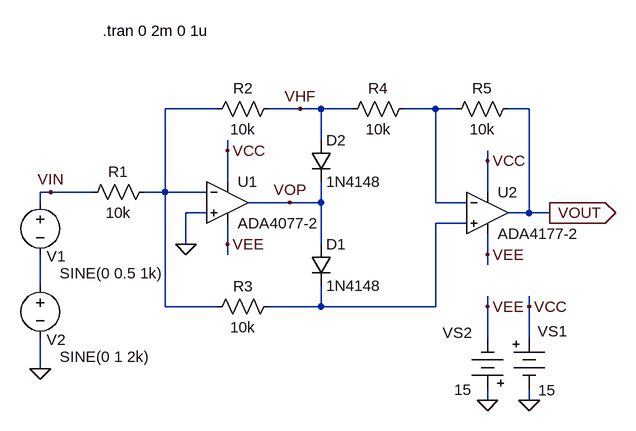
[diagram p0: schematic fig-01-03-14.asc]
fig-01-03-14.asc, the LTspice schematic file:
Version 4
SHEET 1 880 680
WIRE 192 32 112 32
WIRE 320 32 272 32
WIRE 352 32 320 32
WIRE 400 32 352 32
WIRE 528 32 480 32
WIRE 560 32 528 32
WIRE 672 32 640 32
WIRE 352 80 352 32
WIRE 208 96 208 80
WIRE 608 112 608 96
WIRE 208 144 208 96
WIRE -64 160 -80 160
WIRE 0 160 -64 160
WIRE 112 160 112 32
WIRE 112 160 80 160
WIRE 176 160 112 160
WIRE 608 160 608 112
WIRE -80 176 -80 160
WIRE 304 176 240 176
WIRE 352 176 352 144
WIRE 352 176 304 176
WIRE 528 176 528 32
WIRE 576 176 528 176
WIRE 176 192 144 192
WIRE 672 192 672 32
WIRE 672 192 640 192
WIRE 704 192 672 192
WIRE 576 208 528 208
WIRE 144 240 144 192
WIRE 208 240 208 208
WIRE 352 240 352 176
WIRE 208 256 208 240
WIRE 608 256 608 224
WIRE 608 272 608 256
WIRE -80 304 -80 256
WIRE 112 336 112 160
WIRE 192 336 112 336
WIRE 352 336 352 304
WIRE 352 336 272 336
WIRE 528 336 528 208
WIRE 528 336 352 336
WIRE 608 336 608 320
WIRE 672 336 672 320
WIRE 608 384 608 336
WIRE 672 384 672 336
WIRE -80 432 -80 384
WIRE 608 480 608 464
WIRE 672 480 672 464
FLAG -80 432 0
FLAG -64 160 VIN
FLAG 608 480 0
FLAG 672 480 0
FLAG 608 336 VEE
FLAG 672 336 VCC
FLAG 208 96 VCC
FLAG 208 240 VEE
FLAG 144 240 0
FLAG 704 192 VOUT
IOPIN 704 192 Out
FLAG 304 176 VOP
FLAG 608 112 VCC
FLAG 608 256 VEE
FLAG 320 32 VHF
SYMBOL voltage -80 160 R0
WINDOW 0 10 99 Left 2
WINDOW 3 30 125 Left 2
WINDOW 123 0 0 Left 0
WINDOW 39 0 0 Left 0
SYMATTR InstName V1
SYMATTR Value SINE(0 0.5 1k)
SYMBOL diode 336 80 R0
SYMATTR InstName D2
SYMATTR Value 1N4148
SYMBOL Misc\\battery 672 368 R0
WINDOW 0 13 6 Left 2
WINDOW 3 14 97 Left 2
SYMATTR InstName VS1
SYMATTR Value 15
SYMBOL Misc\\battery 608 480 R180
WINDOW 0 24 104 Left 2
WINDOW 3 24 16 Left 2
SYMATTR InstName VS2
SYMATTR Value 15
SYMBOL diode 336 240 R0
SYMATTR InstName D1
SYMATTR Value 1N4148
SYMBOL res 96 144 R90
WINDOW 0 0 56 VBottom 2
WINDOW 3 32 56 VTop 2
SYMATTR InstName R1
SYMATTR Value 10k
SYMBOL res 288 16 R90
WINDOW 0 0 56 VBottom 2
WINDOW 3 32 56 VTop 2
SYMATTR InstName R2
SYMATTR Value 10k
SYMBOL voltage -80 288 R0
WINDOW 0 10 99 Left 2
WINDOW 3 30 125 Left 2
WINDOW 123 0 0 Left 0
WINDOW 39 0 0 Left 0
SYMATTR InstName V2
SYMATTR Value SINE(0 1 2k)
SYMBOL res 288 320 R90
WINDOW 0 0 56 VBottom 2
WINDOW 3 32 56 VTop 2
SYMATTR InstName R3
SYMATTR Value 10k
SYMBOL res 496 16 R90
WINDOW 0 0 56 VBottom 2
WINDOW 3 32 56 VTop 2
SYMATTR InstName R4
SYMATTR Value 10k
SYMBOL res 656 16 R90
WINDOW 0 0 56 VBottom 2
WINDOW 3 32 56 VTop 2
SYMATTR InstName R5
SYMATTR Value 10k
SYMBOL Opamps\\ADA4177-2 608 192 R0
SYMATTR InstName U2
SYMBOL Opamps\\ADA4077-2 208 112 R0
SYMATTR InstName U1
TEXT 16 -88 Left 2 !.tran 0 2m 0 1u

The netlist it stands for:
* fig-01-03-14.asc
V1 VIN N004 SINE(0 0.5 1k)
D2 VHF VOP 1N4148
VS1 VCC 0 15
VS2 0 VEE 15
D1 VOP N003 1N4148
R1 N001 VIN 10k
R2 VHF N001 10k
V2 N004 0 SINE(0 1 2k)
R3 N003 N001 10k
R4 N002 VHF 10k
R5 VOUT N002 10k
* U2: ADA4177-2 (symbol Opamps\ADA4177-2 not available, pins judged from their places): In+=N003 In-=N002 V+=VCC V-=VEE OUT=VOUT
XU1 0 N001 VCC VEE VOP ADA4077-2  ; pins In+ In- V+ V- OUT
.model D D
.lib standard.dio
.tran 0 2m 0 1u
.backanno
.end